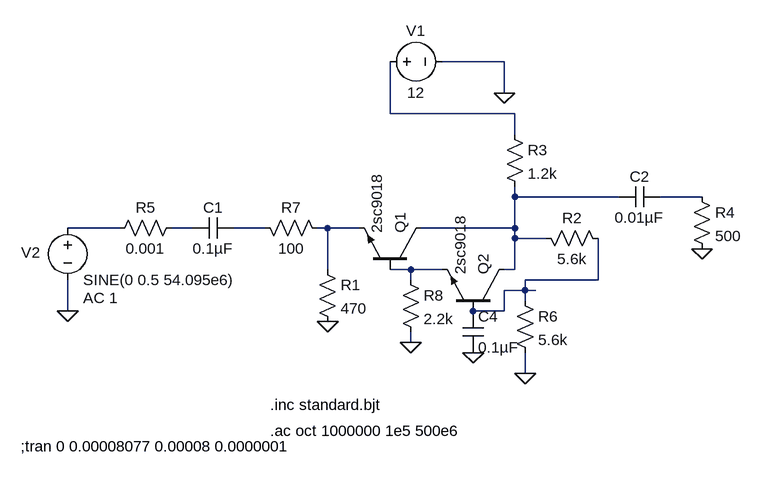
[diagram p0: schematic MMIC-BJT-amp-gain-common-base.asc]
MMIC-BJT-amp-gain-common-base.asc, the LTspice schematic file:
Version 4
SHEET 1 880 680
WIRE 368 -112 272 -112
WIRE 368 -64 368 -112
WIRE 192 -32 192 -112
WIRE 384 -32 192 -32
WIRE 384 0 384 -32
WIRE 384 96 384 80
WIRE 544 96 384 96
WIRE 672 96 608 96
WIRE -224 144 -304 144
WIRE -112 144 -144 144
WIRE 0 144 -48 144
WIRE 96 144 80 144
WIRE 144 144 96 144
WIRE 384 144 384 96
WIRE 384 144 240 144
WIRE 384 160 384 144
WIRE 432 160 384 160
WIRE 96 208 96 144
WIRE 224 208 192 208
WIRE 272 208 224 208
WIRE 384 208 384 160
WIRE 384 208 368 208
WIRE 224 224 224 208
WIRE 512 224 512 160
WIRE 512 224 400 224
WIRE 400 240 400 224
WIRE 400 240 368 240
WIRE 416 240 400 240
WIRE 400 256 400 240
WIRE -304 272 -304 224
WIRE 368 272 368 240
WIRE 368 272 320 272
WIRE 224 320 224 304
WIRE 400 368 400 336
FLAG 400 368 0
FLAG 368 -64 0
FLAG -304 272 0
FLAG 96 288 0
FLAG 672 176 0
FLAG 320 336 0
FLAG 224 320 0
SYMBOL res 80 192 R0
SYMATTR InstName R1
SYMATTR Value 470
SYMATTR SpiceLine tol=1% pwr=1
SYMBOL npn 240 208 M270
SYMATTR InstName Q1
SYMATTR Value 2sc9018
SYMBOL voltage 176 -112 R270
WINDOW 0 32 56 VTop 2
WINDOW 3 -32 56 VBottom 2
WINDOW 123 0 0 Left 2
WINDOW 39 4 56 VTop 2
SYMATTR InstName V1
SYMATTR Value 12
SYMBOL voltage -304 128 R0
WINDOW 123 24 124 Left 2
WINDOW 39 0 0 Left 2
WINDOW 0 -71 54 Left 2
SYMATTR Value2 AC 1
SYMATTR InstName V2
SYMATTR Value SINE(0 0.5 54.095e6)
SYMBOL res 656 80 R0
SYMATTR InstName R4
SYMATTR Value 500
SYMATTR SpiceLine tol=1% pwr=1
SYMBOL res -240 160 R270
WINDOW 0 32 56 VTop 2
WINDOW 3 0 56 VBottom 2
SYMATTR InstName R5
SYMATTR Value 0.001
SYMATTR SpiceLine tol=1% pwr=1
SYMBOL res 384 240 R0
SYMATTR InstName R6
SYMATTR Value 5.6k
SYMBOL res 528 176 M270
WINDOW 0 32 56 VTop 2
WINDOW 3 0 56 VBottom 2
SYMATTR InstName R2
SYMATTR Value 5.6k
SYMATTR SpiceLine tol=1% pwr=1
SYMBOL cap -48 160 M270
WINDOW 0 32 32 VTop 2
WINDOW 3 0 32 VBottom 2
SYMATTR InstName C1
SYMATTR Value 0.1µF
SYMBOL res 368 -16 R0
SYMATTR InstName R3
SYMATTR Value 1.2k
SYMBOL cap 544 80 M90
WINDOW 0 0 32 VBottom 2
WINDOW 3 32 32 VTop 2
SYMATTR InstName C2
SYMATTR Value 0.01µF
SYMBOL res -16 128 M90
WINDOW 0 0 56 VBottom 2
WINDOW 3 32 56 VTop 2
SYMATTR InstName R7
SYMATTR Value 100
SYMBOL npn 368 272 M270
SYMATTR InstName Q2
SYMATTR Value 2sc9018
SYMBOL cap 304 272 R0
SYMATTR InstName C4
SYMATTR Value 0.1µF
SYMBOL res 208 208 R0
SYMATTR InstName R8
SYMATTR Value 2.2k
TEXT 8 416 Left 2 !.inc standard.bjt
TEXT 8 456 Left 2 !.ac oct 1000000 1e5 500e6
TEXT -376 480 Left 2 !;tran 0 0.00008077 0.00008 0.0000001

The netlist it stands for:
* MMIC-BJT-amp-gain-common-base.asc
R1 N007 0 470 tol=1% pwr=1
Q1 N002 N008 N007 0 2sc9018
V1 N001 0 12
V2 N004 0 SINE(0 0.5 54.095e6) AC 1
R4 N003 0 500 tol=1% pwr=1
R5 N004 N005 0.001 tol=1% pwr=1
R6 N009 0 5.6k
R2 N009 N002 5.6k tol=1% pwr=1
C1 N006 N005 0.1µF
R3 N001 N002 1.2k
C2 N002 N003 0.01µF
R7 N006 N007 100
Q2 N002 N009 N008 0 2sc9018
C4 N009 0 0.1µF
R8 N008 0 2.2k
.model NPN NPN
.model PNP PNP
.lib standard.bjt
.inc standard.bjt
.ac oct 1000000 1e5 500e6
;tran 0 0.00008077 0.00008 0.0000001
.backanno
.end